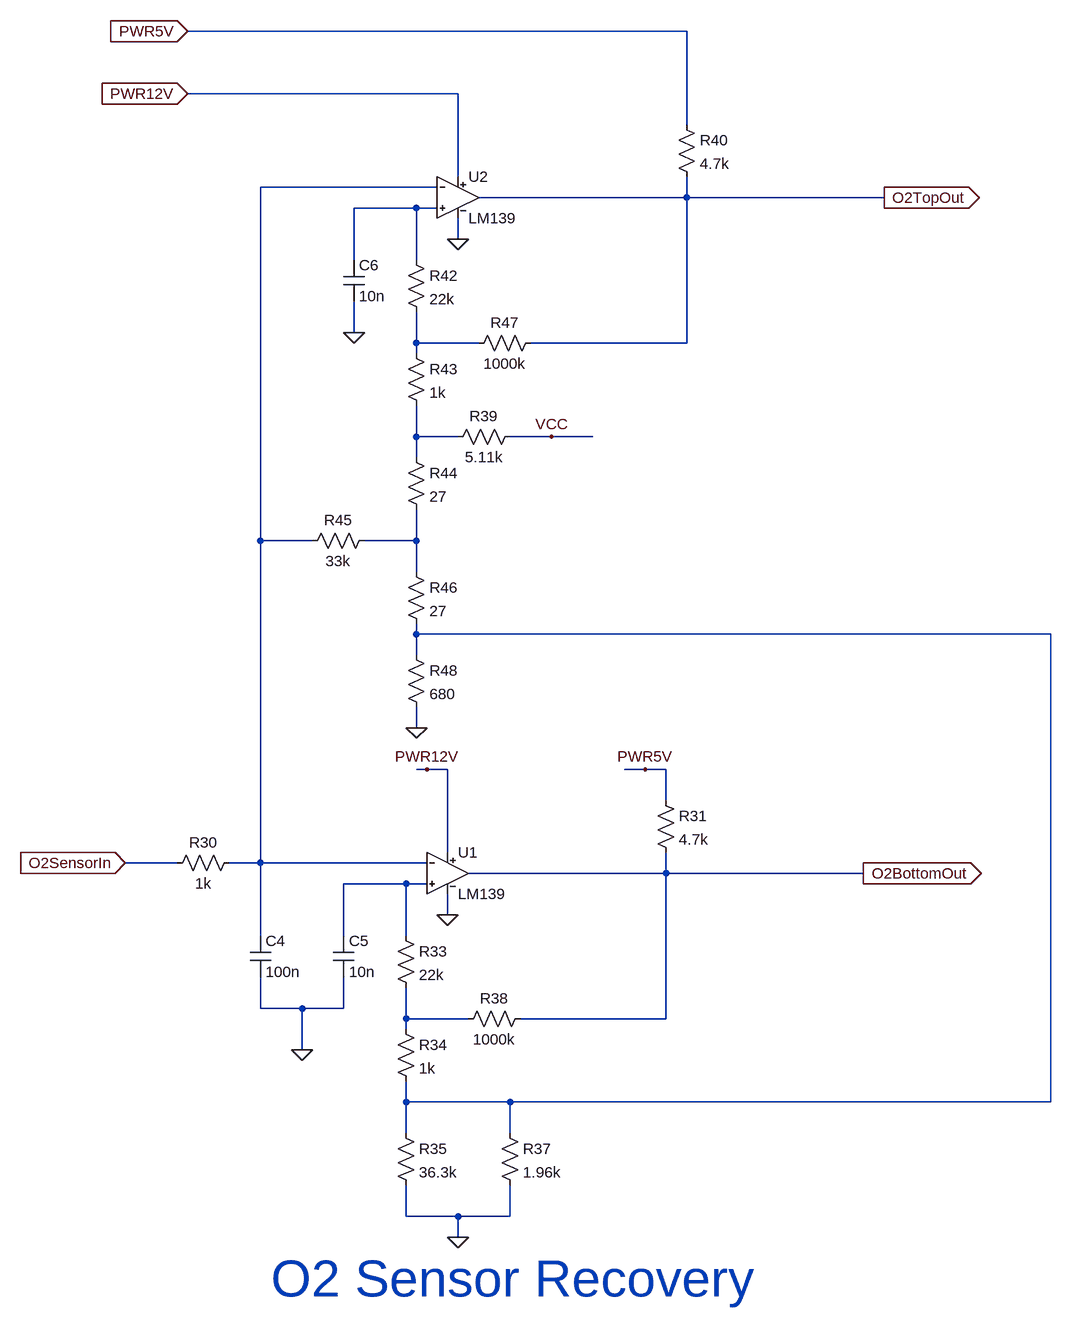
[diagram p0: schematic dme_analog_O2_recovery.asc]
dme_analog_O2_recovery.asc, the LTspice schematic file:
Version 4
SHEET 1 4356 3824
WIRE 224 -2832 -544 -2832
WIRE -128 -2736 -544 -2736
WIRE 224 -2688 224 -2832
WIRE -128 -2608 -128 -2736
WIRE -160 -2592 -432 -2592
WIRE 224 -2576 -96 -2576
WIRE 224 -2576 224 -2608
WIRE 528 -2576 224 -2576
WIRE -192 -2560 -288 -2560
WIRE -160 -2560 -192 -2560
WIRE -128 -2512 -128 -2544
WIRE -288 -2480 -288 -2560
WIRE -192 -2480 -192 -2560
WIRE -288 -2368 -288 -2416
WIRE -192 -2352 -192 -2400
WIRE -96 -2352 -192 -2352
WIRE 224 -2352 224 -2576
WIRE 224 -2352 -16 -2352
WIRE -192 -2336 -192 -2352
WIRE -192 -2208 -192 -2256
WIRE -128 -2208 -192 -2208
WIRE 16 -2208 -48 -2208
WIRE 80 -2208 16 -2208
WIRE -192 -2176 -192 -2208
WIRE -432 -2048 -432 -2592
WIRE -352 -2048 -432 -2048
WIRE -192 -2048 -192 -2096
WIRE -192 -2048 -272 -2048
WIRE -192 -2000 -192 -2048
WIRE -192 -1904 -192 -1920
WIRE 784 -1904 -192 -1904
WIRE -192 -1872 -192 -1904
WIRE -192 -1760 -192 -1792
WIRE -176 -1696 -192 -1696
WIRE -144 -1696 -176 -1696
WIRE 160 -1696 128 -1696
WIRE 192 -1696 160 -1696
WIRE 192 -1648 192 -1696
WIRE -144 -1568 -144 -1696
WIRE -560 -1552 -640 -1552
WIRE -432 -1552 -432 -2048
WIRE -432 -1552 -480 -1552
WIRE -176 -1552 -432 -1552
WIRE 192 -1536 192 -1568
WIRE 192 -1536 -112 -1536
WIRE 496 -1536 192 -1536
WIRE -208 -1520 -304 -1520
WIRE -176 -1520 -208 -1520
WIRE -144 -1472 -144 -1504
WIRE -432 -1440 -432 -1552
WIRE -304 -1440 -304 -1520
WIRE -208 -1440 -208 -1520
WIRE -432 -1328 -432 -1376
WIRE -368 -1328 -432 -1328
WIRE -304 -1328 -304 -1376
WIRE -304 -1328 -368 -1328
WIRE -208 -1312 -208 -1360
WIRE -112 -1312 -208 -1312
WIRE 192 -1312 192 -1536
WIRE 192 -1312 -32 -1312
WIRE -208 -1296 -208 -1312
WIRE -368 -1264 -368 -1328
WIRE -208 -1184 -208 -1216
WIRE -48 -1184 -208 -1184
WIRE 784 -1184 784 -1904
WIRE 784 -1184 -48 -1184
WIRE -208 -1136 -208 -1184
WIRE -48 -1136 -48 -1184
WIRE -208 -1008 -208 -1056
WIRE -128 -1008 -208 -1008
WIRE -48 -1008 -48 -1056
WIRE -48 -1008 -128 -1008
WIRE -128 -976 -128 -1008
FLAG -176 -1696 PWR12V
FLAG -144 -1472 0
FLAG -640 -1552 O2SensorIn
IOPIN -640 -1552 In
FLAG -368 -1264 0
FLAG 160 -1696 PWR5V
FLAG -128 -976 0
FLAG 496 -1536 O2BottomOut
IOPIN 496 -1536 Out
FLAG -128 -2512 0
FLAG 528 -2576 O2TopOut
IOPIN 528 -2576 Out
FLAG -288 -2368 0
FLAG 16 -2208 VCC
FLAG -192 -1760 0
FLAG -544 -2832 PWR5V
IOPIN -544 -2832 In
FLAG -544 -2736 PWR12V
IOPIN -544 -2736 In
SYMBOL res -464 -1568 R90
WINDOW 0 0 56 VBottom 2
WINDOW 3 32 56 VTop 2
SYMATTR InstName R30
SYMATTR Value 1k
SYMBOL Res 176 -1664 R0
SYMATTR InstName R31
SYMATTR Value 4.7k
SYMBOL Cap -448 -1440 R0
SYMATTR InstName C4
SYMATTR Value 100n
SYMBOL Cap -320 -1440 R0
SYMATTR InstName C5
SYMATTR Value 10n
SYMBOL Res -224 -1456 R0
SYMATTR InstName R33
SYMATTR Value 22k
SYMBOL Res -224 -1312 R0
SYMATTR InstName R34
SYMATTR Value 1k
SYMBOL Res -224 -1152 R0
SYMATTR InstName R35
SYMATTR Value 36.3k
SYMBOL Res -64 -1152 R0
SYMATTR InstName R37
SYMATTR Value 1.96k
SYMBOL Res -16 -1328 R90
WINDOW 0 0 56 VBottom 2
WINDOW 3 32 56 VTop 2
SYMATTR InstName R38
SYMATTR Value 1000k
SYMBOL Res 208 -2704 R0
SYMATTR InstName R40
SYMATTR Value 4.7k
SYMBOL Cap -304 -2480 R0
SYMATTR InstName C6
SYMATTR Value 10n
SYMBOL Res -208 -2496 R0
SYMATTR InstName R42
SYMATTR Value 22k
SYMBOL Res -208 -2352 R0
SYMATTR InstName R43
SYMATTR Value 1k
SYMBOL Res -208 -2192 R0
SYMATTR InstName R44
SYMATTR Value 27
SYMBOL Res 0 -2368 R90
WINDOW 0 0 56 VBottom 2
WINDOW 3 32 56 VTop 2
SYMATTR InstName R47
SYMATTR Value 1000k
SYMBOL Res -32 -2224 R90
WINDOW 0 0 56 VBottom 2
WINDOW 3 32 56 VTop 2
SYMATTR InstName R39
SYMATTR Value 5.11k
SYMBOL Res -256 -2064 R90
WINDOW 0 0 56 VBottom 2
WINDOW 3 32 56 VTop 2
SYMATTR InstName R45
SYMATTR Value 33k
SYMBOL Res -208 -2016 R0
SYMATTR InstName R46
SYMATTR Value 27
SYMBOL Res -208 -1888 R0
SYMATTR InstName R48
SYMATTR Value 680
SYMBOL lm139 -144 -1536 R0
SYMATTR InstName U1
SYMBOL lm139 -128 -2576 R0
SYMATTR InstName U2
TEXT -416 -912 Left 6 ;O2 Sensor Recovery

The netlist it stands for:
* dme_analog_O2_recovery.asc
R30 N001 O2SensorIn 1k
R31 PWR5V O2BottomOut 4.7k
C4 N001 0 100n
C5 N007 0 10n
R33 N007 N008 22k
R34 N008 N006 1k
R35 N006 0 36.3k
R37 N006 0 1.96k
R38 O2BottomOut N008 1000k
R40 PWR5V O2TopOut 4.7k
C6 N002 0 10n
R42 N002 N003 22k
R43 N003 N004 1k
R44 N004 N005 27
R47 O2TopOut N003 1000k
R39 VCC N004 5.11k
R45 N005 N001 33k
R46 N005 N006 27
R48 N006 0 680
XU1 N007 N001 PWR12V 0 O2BottomOut LM139  ; pins In+ In- V+ V- OUT
XU2 N002 N001 PWR12V 0 O2TopOut LM139  ; pins In+ In- V+ V- OUT
* O2 Sensor Recovery
.lib lm139.cir
.backanno
.end